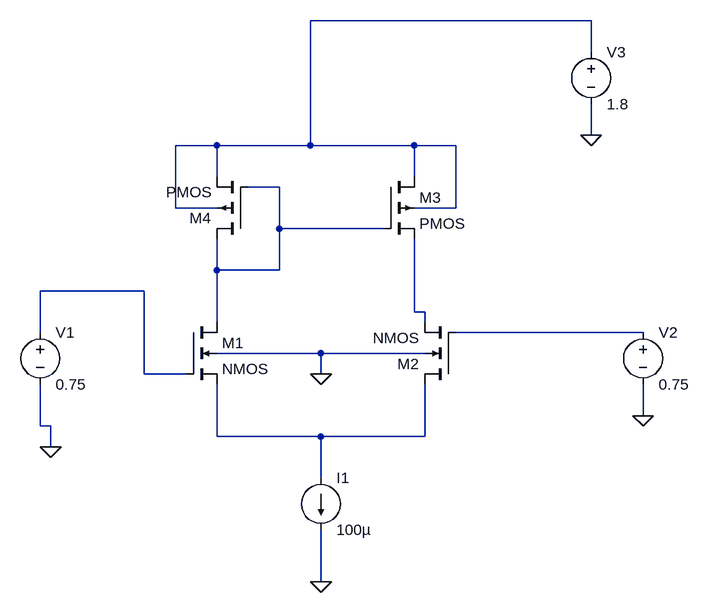
[diagram p0: schematic diff_amp_pmos_load.asc]
diff_amp_pmos_load.asc, the LTspice schematic file:
Version 4
SHEET 1 880 680
WIRE 672 -288 240 -288
WIRE 672 -240 672 -288
WIRE 672 -112 672 -160
WIRE 96 -96 32 -96
WIRE 240 -96 240 -288
WIRE 240 -96 96 -96
WIRE 400 -96 240 -96
WIRE 464 -96 400 -96
WIRE 96 -48 96 -96
WIRE 400 -48 400 -96
WIRE 192 -32 144 -32
WIRE 32 0 32 -96
WIRE 96 0 32 0
WIRE 464 0 464 -96
WIRE 464 0 400 0
WIRE 192 32 192 -32
WIRE 352 32 192 32
WIRE 96 96 96 48
WIRE 192 96 192 32
WIRE 192 96 96 96
WIRE -16 128 -176 128
WIRE 400 160 400 48
WIRE 416 160 400 160
WIRE 96 176 96 96
WIRE 416 176 416 160
WIRE -176 192 -176 128
WIRE 752 192 464 192
WIRE 256 224 96 224
WIRE 416 224 256 224
WIRE -16 256 -16 128
WIRE 48 256 -16 256
WIRE 256 256 256 224
WIRE 752 320 752 272
WIRE -176 336 -176 272
WIRE -160 336 -176 336
WIRE 96 352 96 272
WIRE 256 352 96 352
WIRE 416 352 416 272
WIRE 416 352 256 352
WIRE -160 368 -160 336
WIRE 256 416 256 352
WIRE 256 576 256 496
FLAG 256 576 0
FLAG 752 320 0
FLAG -160 368 0
FLAG 672 -112 0
FLAG 256 256 0
SYMBOL nmos4 48 176 R0
SYMATTR InstName M1
SYMATTR Value2 l=180u w=1u
SYMBOL nmos4 464 272 R180
SYMATTR InstName M2
SYMATTR Value2 l=180u w=1u
SYMBOL pmos4 352 -48 R0
SYMATTR InstName M3
SYMATTR Value2 l=180u w=1u
SYMBOL pmos4 144 48 R180
SYMATTR InstName M4
SYMATTR Value2 l=180u w=1u
SYMBOL current 256 416 R0
WINDOW 123 0 0 Left 2
WINDOW 39 0 0 Left 2
SYMATTR InstName I1
SYMATTR Value 100µ
SYMBOL voltage -176 176 R0
WINDOW 123 0 0 Left 2
WINDOW 39 0 0 Left 2
SYMATTR InstName V1
SYMATTR Value 0.75
SYMBOL voltage 752 176 R0
WINDOW 123 0 0 Left 2
WINDOW 39 0 0 Left 2
SYMATTR InstName V2
SYMATTR Value 0.75
SYMBOL voltage 672 -256 R0
WINDOW 123 0 0 Left 2
WINDOW 39 0 0 Left 2
SYMATTR InstName V3
SYMATTR Value 1.8

The netlist it stands for:
* diff_amp_pmos_load.asc
M1 N002 N003 N006 0 NMOS l=180u w=1u
M2 N006 N005 N004 0 NMOS l=180u w=1u
M3 N001 N002 N004 N001 PMOS l=180u w=1u
M4 N002 N002 N001 N001 PMOS l=180u w=1u
I1 N006 0 100µ
V1 N003 0 0.75
V2 N005 0 0.75
V3 N001 0 1.8
.model NMOS NMOS
.model PMOS PMOS
.lib standard.mos
.backanno
.end